# EAGLE design microBoard_HMI (EAGLE 6.2)

## Sheet 1 of 3: Power Supplies & Interfaces
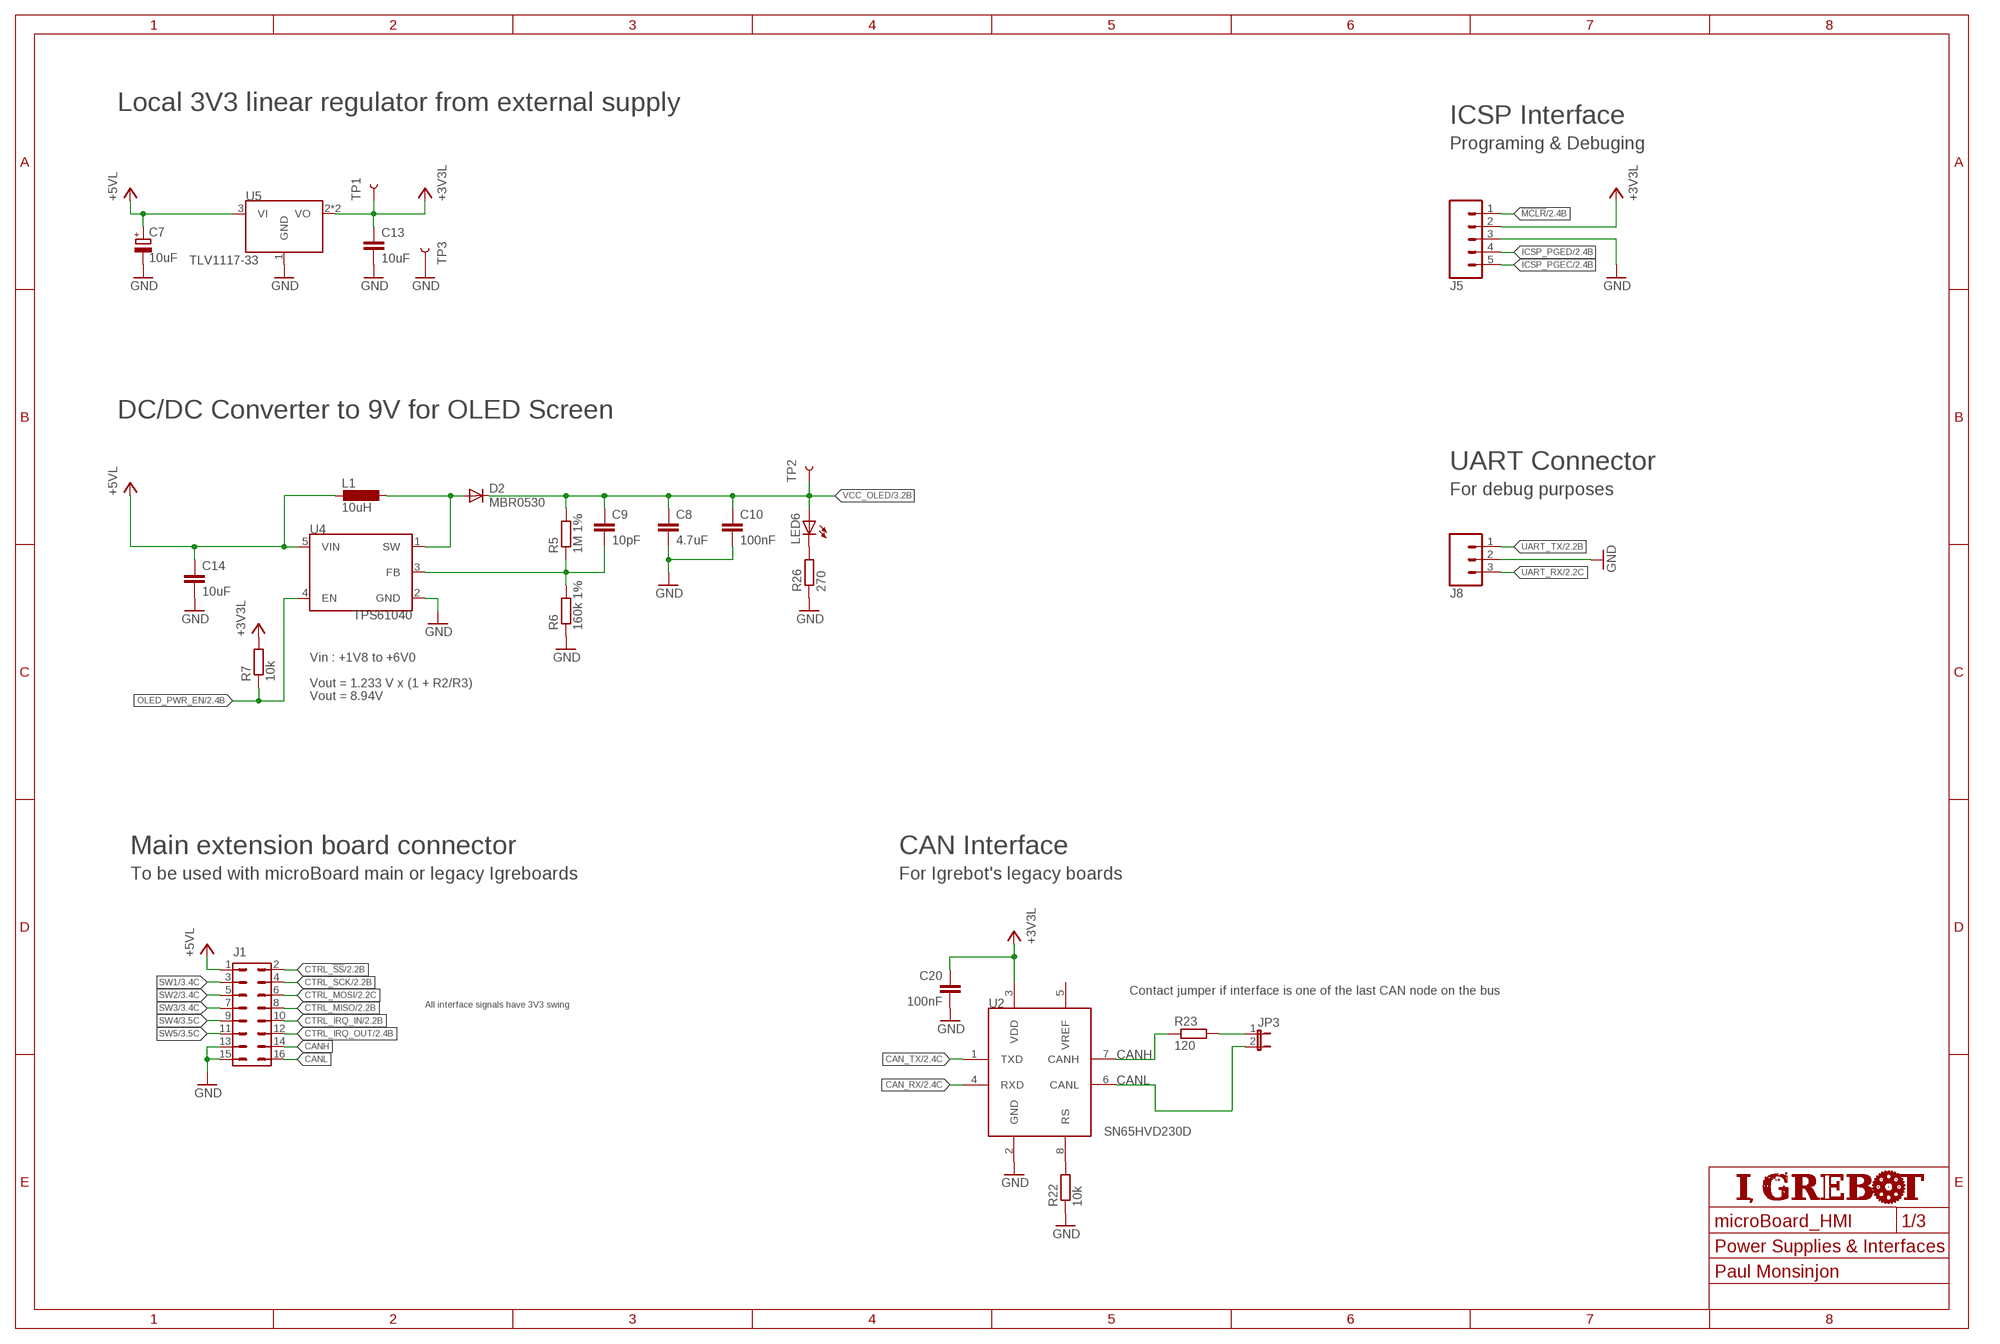
[diagram p0: schematic, sheet 1]
POWER-SUPPLIES2 (FRAME_A3): AUTHOR: Paul Monsinjon; SHEET_NAME: Power Supplies & Interfaces

### Parts
C7  10uF  CPOL-EUC  [PANASONIC_C]
C8  4.7uF  C-EUC1206  [C1206]
C9  10pF  C-EUC0603  [C0603]
C10  100nF  C-EUC0603  [C0603]
C13  10uF  C-EUC1206  [C1206]
C14  10uF  C-EUC1206  [C1206]
C20  100nF  C-EUC0603  [C0603]
D2  MBR0530  CGRM4001-G  [SOD-123_MINI-SMA]
J1  HE10_H_16  [CON_2X_2.54_H_16]
J5  M05LOCK  [1X05_LOCK]
J8  M03LOCK  [1X03_LOCK]
JP3  JUMPER-2PTH_LOCK  [1X02_LOCK]
L1  10uH  L-EUL5650M  [L5650M]
LED6  LEDCHIP-LED0805  [CHIP-LED0805]
R5  1M 1%  R-EU_R0603  [R0603]
R6  160k 1%  R-EU_R0603  [R0603]
R7  10k  R-EU_R0603  [R0603]
R22  10k  R-EU_R0603  [R0603]
R23  120  R-EU_R0603  [R0603]
R26  270  R-EU_R0603  [R0603]
TP1  TEST-POINT3X5  [PAD.03X.05]
TP2  TEST-POINT3X5  [PAD.03X.05]
TP3  TEST-POINT3X5  [PAD.03X.05]
U2  SN65HVD230D  MCP2551  [SO-08]
U4  TPS61040  [SOT-23]
U5  TLV1117-33  NX1117C  [SOT_223]

### Nets
!MCLR!: J5.1 ; also sheet 2
+3V3L: C13.1 C20.1 J5.2 R7.2 TP1.P$1 U2.3(VDD) U5.2(VO) U5.4(VO) ; also sheet 2,3
+5VL: C7.+ C14.1 J1.1 L1.2 U4.5(VIN) U5.3(VI) ; also sheet 3
CAN_RX: U2.4(RXD) ; also sheet 2
CAN_TX: U2.1(TXD) ; also sheet 2
CANH: J1.14 R23.1 U2.7(CANH)
CANL: J1.16 JP3.2 U2.6(CANL)
CTRL_!SS!: J1.2 ; also sheet 2
CTRL_IRQ_IN: J1.10 ; also sheet 2
CTRL_IRQ_OUT: J1.12 ; also sheet 2
CTRL_MISO: J1.8 ; also sheet 2
CTRL_MOSI: J1.6 ; also sheet 2
CTRL_SCK: J1.4 ; also sheet 2
GND: C7.- C8.2 C10.2 C13.2 C14.2 C20.2 J1.13 J1.15 J5.3 J8.2 R6.1 R22.1 R26.1 TP3.P$1 U2.2(GND) U4.2(GND) U5.1(GND) ; also sheet 2,3
ICSP_PGEC: J5.5 ; also sheet 2
ICSP_PGED: J5.4 ; also sheet 2
N$3: D2.A L1.1 U4.1(SW)
N$5: C9.2 R5.1 R6.2 U4.3(FB)
N$8: LED6.C R26.2
N$15: JP3.1 R23.2
N$22: R22.2 U2.8(RS)
OLED_PWR_EN: R7.1 U4.4(EN) ; also sheet 2
SW1: J1.3 ; also sheet 3
SW2: J1.5 ; also sheet 3
SW3: J1.7 ; also sheet 3
SW4: J1.9 ; also sheet 3
SW5: J1.11 ; also sheet 3
UART_RX: J8.3 ; also sheet 2
UART_TX: J8.1 ; also sheet 2
VCC_OLED: C8.1 C9.1 C10.1 D2.C LED6.A R5.2 TP2.P$1 ; also sheet 3
Unconnected: U2.5(VREF)

### Notes on the sheet
- Local 3V3 linear regulator from external supply
- ICSP Interface
- Programing & Debuging
- DC/DC Converter to 9V for OLED Screen
- UART Connector
- For debug purposes
- Vin : +1V8 to +6V0
- Vout = 1.233 V x (1 + R2/R3)
- Vout = 8.94V
- Main extension board connector | CAN Interface
- To be used with microBoard main or legacy Igreboards | For Igrebot's legacy boards
- Contact jumper if interface is one of the last CAN node on the bus
- All interface signals have 3V3 swing

## Sheet 2 of 3: Microcontroller
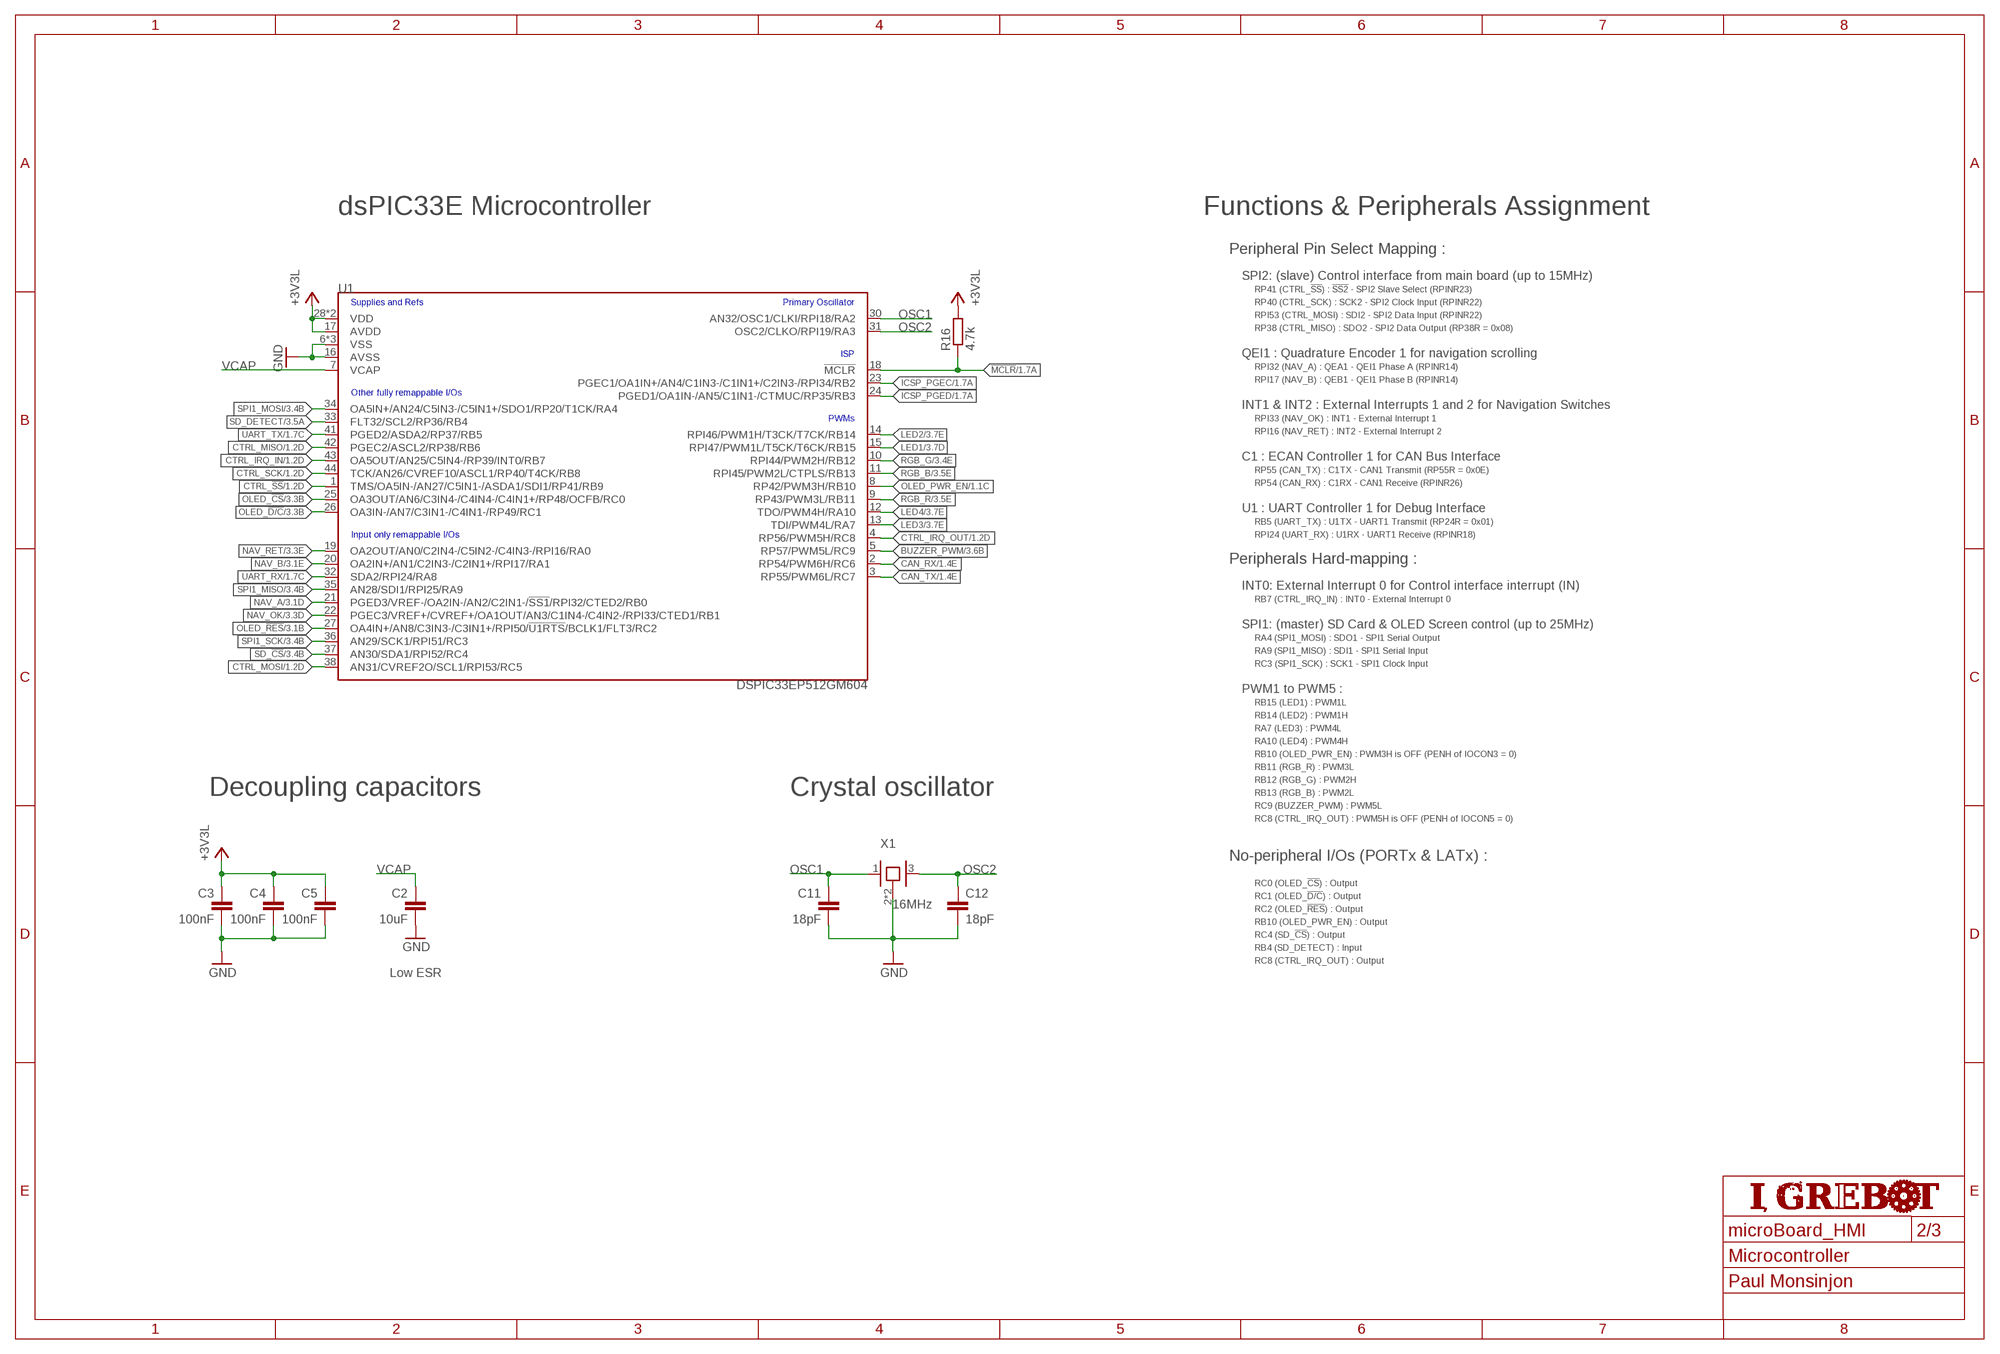
[diagram p1: schematic, sheet 2]
POWER-SUPPLIES1 (FRAME_A3): AUTHOR: Paul Monsinjon; SHEET_NAME: Microcontroller

### Parts
C2  10uF  C-EUC1206  [C1206]
C3  100nF  C-EUC0603  [C0603]
C4  100nF  C-EUC0603  [C0603]
C5  100nF  C-EUC0603  [C0603]
C11  18pF  C-EUC0603  [C0603]
C12  18pF  C-EUC0603  [C0603]
R16  4.7k  R-EU_R0603  [R0603]
U1  DSPIC33EP512GM604  [TQFP_44]
X1  16MHz  XTAL_5X3  [CRYSTAL-OSC-SMD-5X3]

### Nets
!MCLR!: R16.1 U1.18(!MCLR!) ; also sheet 1
+3V3L: C3.1 C4.1 C5.1 R16.2 U1.17(AVDD) U1.28(VDD) U1.40(VDD) ; also sheet 1,3
BUZZER_PWM: U1.5(RP57/PWM5L/RC9) ; also sheet 3
CAN_RX: U1.2(RP54/PWM6H/RC6) ; also sheet 1
CAN_TX: U1.3(RP55/PWM6L/RC7) ; also sheet 1
CTRL_!SS!: U1.1(TMS/OA5IN-/AN27/C5IN1-/ASDA1/SDI1/RP41/RB9) ; also sheet 1
CTRL_IRQ_IN: U1.43(OA5OUT/AN25/C5IN4-/RP39/INT0/RB7) ; also sheet 1
CTRL_IRQ_OUT: U1.4(RP56/PWM5H/RC8) ; also sheet 1
CTRL_MISO: U1.42(PGEC2/ASCL2/RP38/RB6) ; also sheet 1
CTRL_MOSI: U1.38(AN31/CVREF2O/SCL1/RPI53/RC5) ; also sheet 1
CTRL_SCK: U1.44(TCK/AN26/CVREF10/ASCL1/RP40/T4CK/RB8) ; also sheet 1
GND: C2.2 C3.2 C4.2 C5.2 C11.2 C12.2 U1.6(VSS) U1.16(AVSS) U1.29(VSS) U1.39(VSS) X1.2 X1.4 ; also sheet 1,3
ICSP_PGEC: U1.23(PGEC1/OA1IN+/AN4/C1IN3-/C1IN1+/C2IN3-/RPI34/RB2) ; also sheet 1
ICSP_PGED: U1.24(PGED1/OA1IN-/AN5/C1IN1-/CTMUC/RP35/RB3) ; also sheet 1
LED1: U1.15(RPI47/PWM1L/T5CK/T6CK/RB15) ; also sheet 3
LED2: U1.14(RPI46/PWM1H/T3CK/T7CK/RB14) ; also sheet 3
LED3: U1.13(TDI/PWM4L/RA7) ; also sheet 3
LED4: U1.12(TDO/PWM4H/RA10) ; also sheet 3
NAV_A: U1.21(PGED3/VREF-/OA2IN-/AN2/C2IN1-/!SS1!/RPI32/CTED2/RB0) ; also sheet 3
NAV_B: U1.20(OA2IN+/AN1/C2IN3-/C2IN1+/RPI17/RA1) ; also sheet 3
NAV_OK: U1.22(PGEC3/VREF+/CVREF+/OA1OUT/AN3/C1IN4-/C4IN2-/RPI33/CTED1/RB1) ; also sheet 3
NAV_RET: U1.19(OA2OUT/AN0/C2IN4-/C5IN2-/C4IN3-/RPI16/RA0) ; also sheet 3
OLED_!CS!: U1.25(OA3OUT/AN6/C3IN4-/C4IN4-/C4IN1+/RP48/OCFB/RC0) ; also sheet 3
OLED_!D/C!: U1.26(OA3IN-/AN7/C3IN1-/C4IN1-/RP49/RC1) ; also sheet 3
OLED_!RES!: U1.27(OA4IN+/AN8/C3IN3-/C3IN1+/RPI50/!U1RTS!/BCLK1/FLT3/RC2) ; also sheet 3
OLED_PWR_EN: U1.8(RP42/PWM3H/RB10) ; also sheet 1
OSC1: C11.1 U1.30(AN32/OSC1/CLKI/RPI18/RA2) X1.1
OSC2: C12.1 U1.31(OSC2/CLKO/RPI19/RA3) X1.3
RGB_B: U1.11(RPI45/PWM2L/CTPLS/RB13) ; also sheet 3
RGB_G: U1.10(RPI44/PWM2H/RB12) ; also sheet 3
RGB_R: U1.9(RP43/PWM3L/RB11) ; also sheet 3
SD_!CS!: U1.37(AN30/SDA1/RPI52/RC4) ; also sheet 3
SD_DETECT: U1.33(FLT32/SCL2/RP36/RB4) ; also sheet 3
SPI1_MISO: U1.35(AN28/SDI1/RPI25/RA9) ; also sheet 3
SPI1_MOSI: U1.34(OA5IN+/AN24/C5IN3-/C5IN1+/SDO1/RP20/T1CK/RA4) ; also sheet 3
SPI1_SCK: U1.36(AN29/SCK1/RPI51/RC3) ; also sheet 3
UART_RX: U1.32(SDA2/RPI24/RA8) ; also sheet 1
UART_TX: U1.41(PGED2/ASDA2/RP37/RB5) ; also sheet 1
VCAP: C2.1 U1.7(VCAP)

### Notes on the sheet
- dsPIC33E Microcontroller | Functions & Peripherals Assignment
- Peripheral Pin Select Mapping :
- SPI2: (slave) Control interface from main board (up to 15MHz)
- RP41 (CTRL_!SS!) : !SS2! - SPI2 Slave Select (RPINR23)
- RP40 (CTRL_SCK) : SCK2 - SPI2 Clock Input (RPINR22)
- RPI53 (CTRL_MOSI) : SDI2 - SPI2 Data Input (RPINR22)
- RP38 (CTRL_MISO) : SDO2 - SPI2 Data Output (RP38R = 0x08)
- QEI1 : Quadrature Encoder 1 for navigation scrolling
- RPI32 (NAV_A) : QEA1 - QEI1 Phase A (RPINR14)
- RPI17 (NAV_B) : QEB1 - QEI1 Phase B (RPINR14)
- INT1 & INT2 : External Interrupts 1 and 2 for Navigation Switches
- RPI33 (NAV_OK) : INT1 - External Interrupt 1
- RPI16 (NAV_RET) : INT2 - External Interrupt 2
- C1 : ECAN Controller 1 for CAN Bus Interface
- RP55 (CAN_TX) : C1TX - CAN1 Transmit (RP55R = 0x0E)
- RP54 (CAN_RX) : C1RX - CAN1 Receive (RPINR26)
- U1 : UART Controller 1 for Debug Interface
- RB5 (UART_TX) : U1TX - UART1 Transmit (RP24R = 0x01)
- RPI24 (UART_RX) : U1RX - UART1 Receive (RPINR18)
- Peripherals Hard-mapping :
- INT0: External Interrupt 0 for Control interface interrupt (IN)
- RB7 (CTRL_IRQ_IN) : INT0 - External Interrupt 0
- SPI1: (master) SD Card & OLED Screen control (up to 25MHz)
- RA4 (SPI1_MOSI) : SDO1 - SPI1 Serial Output
- RA9 (SPI1_MISO) : SDI1 - SPI1 Serial Input
- RC3 (SPI1_SCK) : SCK1 - SPI1 Clock Input
- PWM1 to PWM5 :
- RB15 (LED1) : PWM1L
- RB14 (LED2) : PWM1H
- RA7 (LED3) : PWM4L
- RA10 (LED4) : PWM4H
- RB10 (OLED_PWR_EN) : PWM3H is OFF (PENH of IOCON3 = 0)
- RB11 (RGB_R) : PWM3L
- RB12 (RGB_G) : PWM2H
- Decoupling capacitors | Crystal oscillator | RB13 (RGB_B) : PWM2L
- RC9 (BUZZER_PWM) : PWM5L
- RC8 (CTRL_IRQ_OUT) : PWM5H is OFF (PENH of IOCON5 = 0)
- No-peripheral I/Os (PORTx & LATx) :
- RC0 (OLED_!CS!) : Output
- RC1 (OLED_!D/C!) : Output
- RC2 (OLED_!RES!) : Output
- RB10 (OLED_PWR_EN) : Output
- RC4 (SD_!CS!) : Output
- RB4 (SD_DETECT) : Input
- RC8 (CTRL_IRQ_OUT) : Output
- Low ESR

## Sheet 3 of 3: Human Machine Interfaces
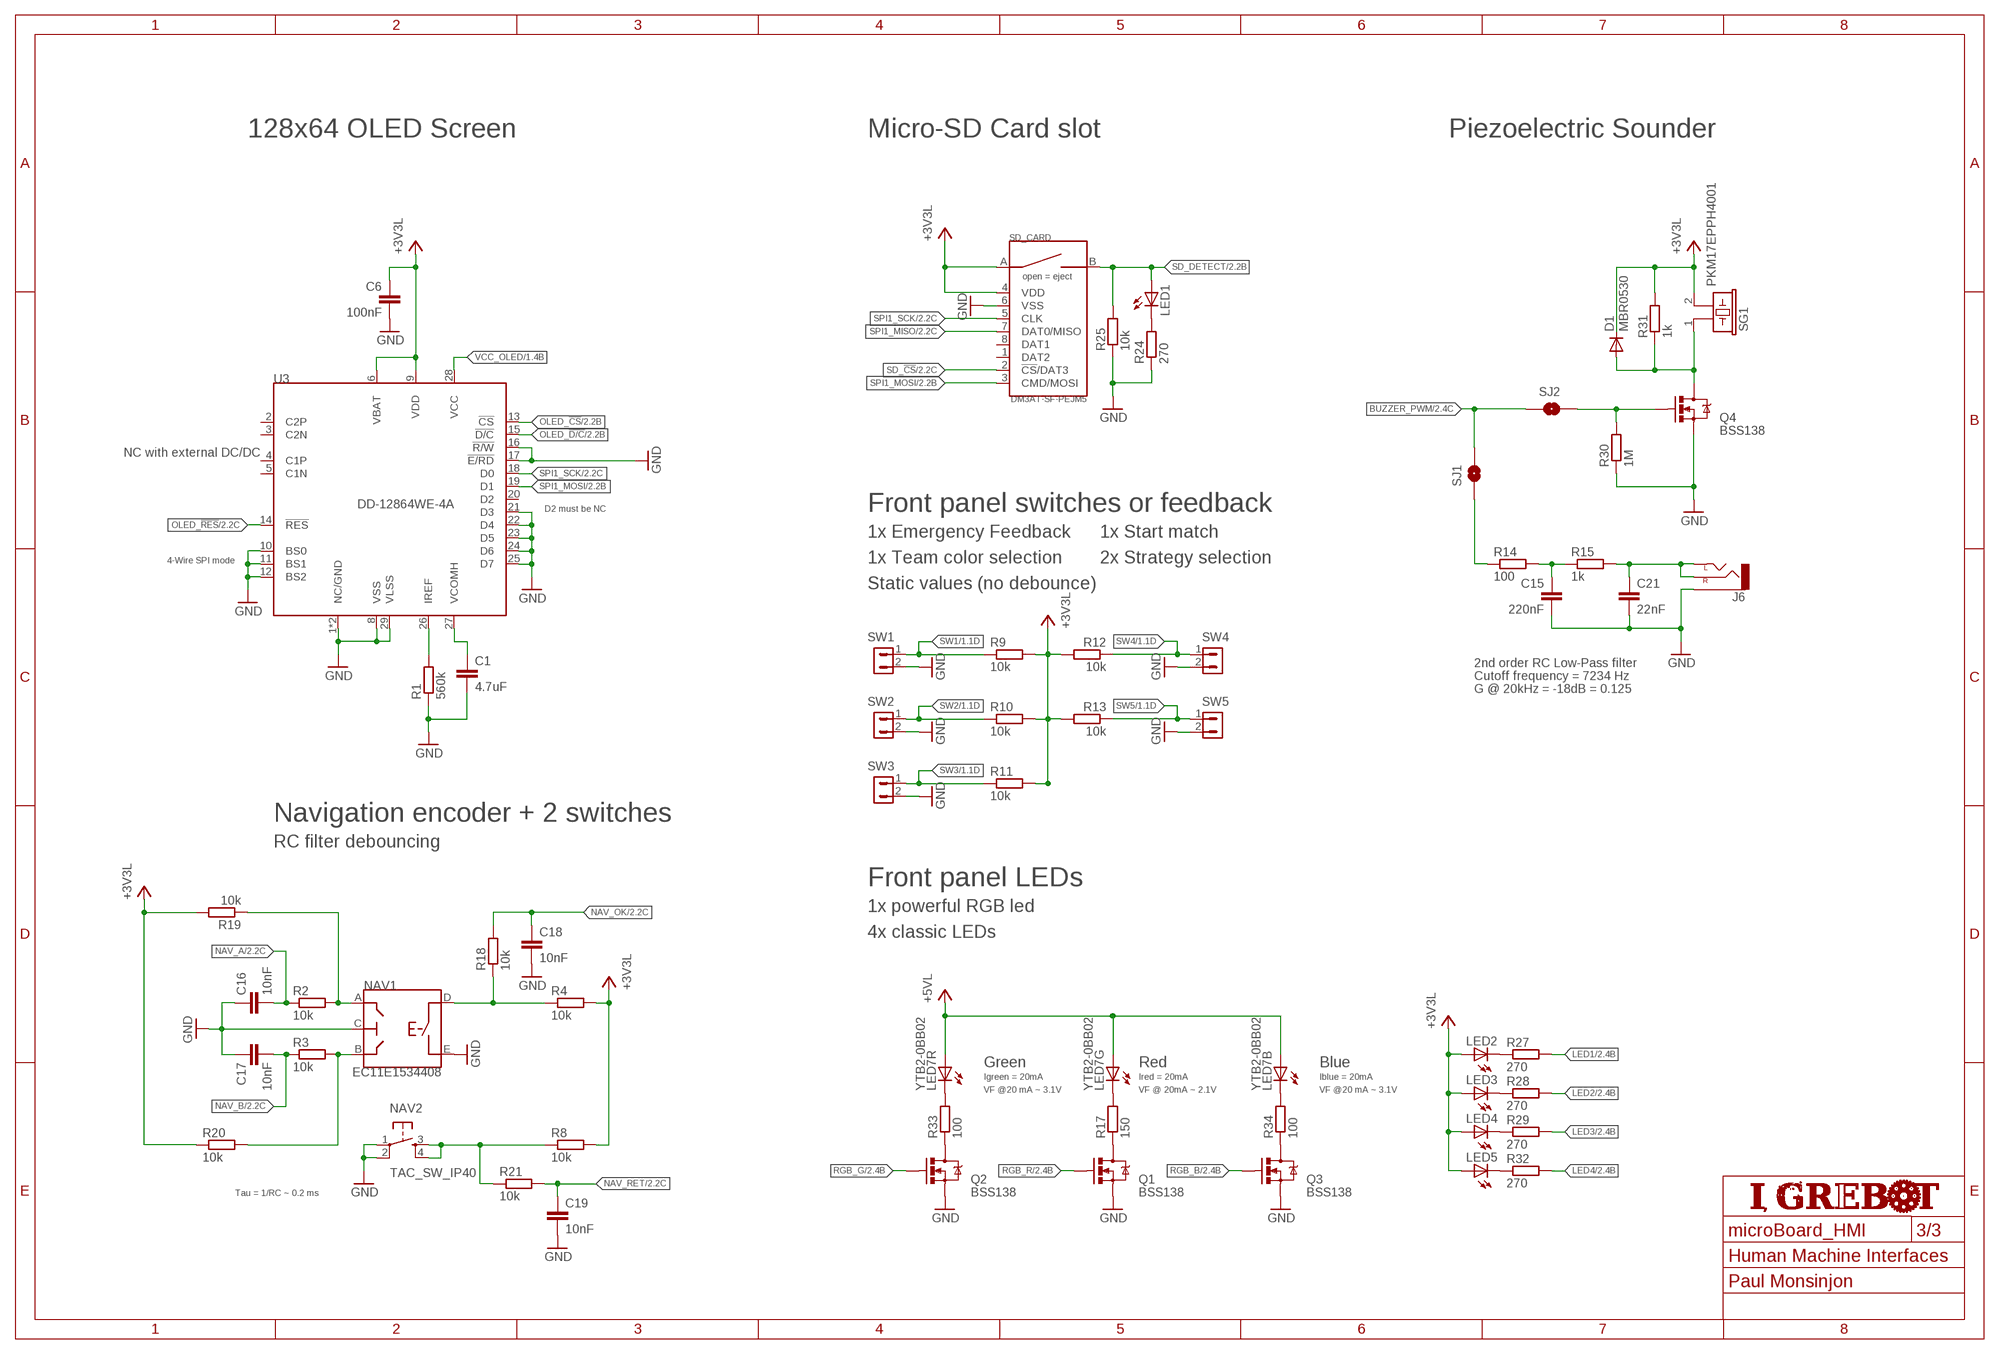
[diagram p2: schematic, sheet 3]
POWER-SUPPLIES (FRAME_A3): AUTHOR: Paul Monsinjon; SHEET_NAME: Human Machine Interfaces

### Parts
C1  4.7uF  C-EUC1206  [C1206]
C6  100nF  C-EUC0603  [C0603]
C15  220nF  C-EUC0603  [C0603]
C16  10nF  C-EUC0603  [C0603]
C17  10nF  C-EUC0603  [C0603]
C18  10nF  C-EUC0603  [C0603]
C19  10nF  C-EUC0603  [C0603]
C21  22nF  C-EUC0603  [C0603]
D1  MBR0530  CGRM4001-G  [SOD-123_MINI-SMA]
J6  AUDIO-JACK1:1  [STEREOJACK2.5MM]
LED1  LEDCHIP-LED0805  [CHIP-LED0805]
LED2  LEDCHIP-LED0805  [CHIP-LED0805]
LED3  LEDCHIP-LED0805  [CHIP-LED0805]
LED4  LEDCHIP-LED0805  [CHIP-LED0805]
LED5  LEDCHIP-LED0805  [CHIP-LED0805]
LED7  YTB2-0BB02  GM5WA94310A  [GM5WA94310A]
NAV1  EC11E1534408  [EC11E1534408]
NAV2  TAC_SW_IP40  [TAC_SW_IP40]
Q1  BSS138  MOSFET-NCHANNELBSS138  [SOT23]
Q2  BSS138  MOSFET-NCHANNELBSS138  [SOT23]
Q3  BSS138  MOSFET-NCHANNELBSS138  [SOT23]
Q4  BSS138  MOSFET-NCHANNELBSS138  [SOT23]
R1  560k  R-EU_R0603  [R0603]
R2  10k  R-EU_R0603  [R0603]
R3  10k  R-EU_R0603  [R0603]
R4  10k  R-EU_R0603  [R0603]
R8  10k  R-EU_R0603  [R0603]
R9  10k  R-EU_R0603  [R0603]
R10  10k  R-EU_R0603  [R0603]
R11  10k  R-EU_R0603  [R0603]
R12  10k  R-EU_R0603  [R0603]
R13  10k  R-EU_R0603  [R0603]
R14  100  R-EU_R0603  [R0603]
R15  1k  R-EU_R0603  [R0603]
R17  150  R-EU_R0603  [R0603]
R18  10k  R-EU_R0603  [R0603]
R19  10k  R-EU_R0603  [R0603]
R20  10k  R-EU_R0603  [R0603]
R21  10k  R-EU_R0603  [R0603]
R24  270  R-EU_R0603  [R0603]
R25  10k  R-EU_R0603  [R0603]
R27  270  R-EU_R0603  [R0603]
R28  270  R-EU_R0603  [R0603]
R29  270  R-EU_R0603  [R0603]
R30  1M  R-EU_R0603  [R0603]
R31  1k  R-EU_R0603  [R0603]
R32  270  R-EU_R0603  [R0603]
R33  100  R-EU_R0603  [R0603]
R34  100  R-EU_R0603  [R0603]
SD_CARD  DM3AT-SF-PEJM5  [DM3AT]
SG1  PKM17EPPH4001  F/EE17P  [F/EE17P]
SJ1  SOLDERJUMPERNC2  [SJ_2S-NOTRACE]
SJ2  SOLDERJUMPERNC2  [SJ_2S-NOTRACE]
SW1  HE14_H_2  [HE14_H_2]
SW2  HE14_H_2  [HE14_H_2]
SW3  HE14_H_2  [HE14_H_2]
SW4  HE14_H_2  [HE14_H_2]
SW5  HE14_H_2  [HE14_H_2]
U3  DD-12864WE-4A  [DD-12864WE-4A]

### Nets
+3V3L: C6.1 D1.C LED2.A LED3.A LED4.A LED5.A R4.2 R8.2 R9.2 R10.2 R11.2 R12.2 R13.2 R19.2 R20.1 R31.2 SD_CARD.4(VDD) SD_CARD.A SG1.2 U3.6(VBAT) U3.9(VDD) ; also sheet 1,2
+5VL: LED7.1(B:A) LED7.2(R:A) LED7.3(G:A) ; also sheet 1
BUZZER_PWM: SJ1.2 SJ2.1 ; also sheet 2
GND: C1.2 C6.2 C15.2 C16.1 C17.1 C18.2 C19.2 C21.2 J6.5(SLEEVE) NAV1.C NAV1.E NAV2.1 NAV2.2 Q1.2(S) Q2.2(S) Q3.2(S) Q4.2(S) R1.1 R24.1 R25.1 R30.1 SD_CARD.6(VSS) SW1.2 SW2.2 SW3.2 SW4.2 SW5.2 U3.1(NC/GND) U3.8(VSS) U3.10(BS0) U3.11(BS1) U3.12(BS2) U3.16(!R/W!) U3.17(!E/RD!) U3.21(D3) U3.22(D4) U3.23(D5) U3.24(D6) U3.25(D7) U3.29(VLSS) U3.30(NC/GND) ; also sheet 1,2
LED1: R27.2 ; also sheet 2
LED2: R28.2 ; also sheet 2
LED3: R29.2 ; also sheet 2
LED4: R32.2 ; also sheet 2
N$1: R1.2 U3.26(IREF)
N$2: C1.1 U3.27(VCOMH)
N$4: LED7.5(R:C) R33.2
N$6: LED7.4(G:C) R17.2
N$7: LED7.6(B:C) R34.2
N$9: Q2.3(D) R33.1
N$10: Q1.3(D) R17.1
N$11: Q3.3(D) R34.1
N$12: C21.1 J6.1(LEFT) J6.4(RIGHT) R15.2
N$13: D1.A Q4.3(D) R31.1 SG1.1
N$14: C15.1 R14.2 R15.1
N$16: R14.1 SJ1.1
N$17: LED1.C R24.2
N$18: NAV1.A R2.2 R19.1
N$19: NAV1.B R3.2 R20.2
N$20: NAV1.D R4.1 R18.1
N$21: NAV2.3 NAV2.4 R8.1 R21.1
N$24: Q4.1(G) R30.2 SJ2.2
N$37: LED2.C R27.1
N$39: LED3.C R28.1
N$40: LED4.C R29.1
N$41: LED5.C R32.1
NAV_A: C16.2 R2.1 ; also sheet 2
NAV_B: C17.2 R3.1 ; also sheet 2
NAV_OK: C18.1 R18.2 ; also sheet 2
NAV_RET: C19.1 R21.2 ; also sheet 2
OLED_!CS!: U3.13(!CS!) ; also sheet 2
OLED_!D/C!: U3.15(!D/C!) ; also sheet 2
OLED_!RES!: U3.14(!RES!) ; also sheet 2
RGB_B: Q3.1(G) ; also sheet 2
RGB_G: Q2.1(G) ; also sheet 2
RGB_R: Q1.1(G) ; also sheet 2
SD_!CS!: SD_CARD.2(!CS!/DAT3) ; also sheet 2
SD_DETECT: LED1.A R25.2 SD_CARD.B ; also sheet 2
SPI1_MISO: SD_CARD.7(DAT0/MISO) ; also sheet 2
SPI1_MOSI: SD_CARD.3(CMD/MOSI) U3.19(D1) ; also sheet 2
SPI1_SCK: SD_CARD.5(CLK) U3.18(D0) ; also sheet 2
SW1: R9.1 SW1.1 ; also sheet 1
SW2: R10.1 SW2.1 ; also sheet 1
SW3: R11.1 SW3.1 ; also sheet 1
SW4: R12.1 SW4.1 ; also sheet 1
SW5: R13.1 SW5.1 ; also sheet 1
VCC_OLED: U3.28(VCC) ; also sheet 1
Unconnected: SD_CARD.1(DAT2) SD_CARD.8(DAT1) U3.2(C2P) U3.3(C2N) U3.4(C1P) U3.5(C1N) U3.20(D2)

### Notes on the sheet
- 128x64 OLED Screen | Micro-SD Card slot | Piezoelectric Sounder
- NC with external DC/DC
- D2 must be NC | Front panel switches or feedback
- 1x Emergency Feedback | 1x Start match
- 4-Wire SPI mode | 1x Team color selection | 2x Strategy selection
- Static values (no debounce)
- 2nd order RC Low-Pass filter
- Cutoff frequency = 7234 Hz
- G @ 20kHz = -18dB = 0.125
- Navigation encoder + 2 switches
- RC filter debouncing
- Front panel LEDs
- 1x powerful RGB led
- 4x classic LEDs
- Green | Red | Blue
- Igreen = 20mA | Ired = 20mA | Iblue = 20mA
- VF @20 mA ~ 3.1V | VF @ 20mA ~ 2.1V | VF @20 mA ~ 3.1V
- Tau = 1/RC ~ 0.2 ms

## Library data of the parts
C1-C6 C8-C21 = rcl:C-EU: CAPACITOR, European symbol
C7 = rcl:CPOL-EU: POLARIZED CAPACITOR, European symbol
D1 D2 = diode:CGRM400*-G: Molded plasitc,JEDEC SOD-123/Mini SMA Source: Comchip CGRM4001-G.pdf
J1 = microLib:HE10_H_16
J5 = SparkFun-Connectors:M05: Header 5 Standard 5-pin 0.1" header. Use with straight break away headers (SKU : PRT-00116), right angle break away headers (PRT-00553), swiss pins (PRT-00743), machine pins (PRT-00117), and female headers (PRT-00115). Molex polarized connector foot print use with SKU : PRT-08230 with associated crimp pins and housings.
J6 = SparkFun-Connectors:AUDIO-JACK: 3.5mm Audio Jack Simple 3.5mm common PCB mount audio jack. SKU: PRT-08032
J8 = SparkFun-Connectors:M03: Header 3 Standard 3-pin 0.1" header. Use with straight break away headers (SKU : PRT-00116), right angle break away headers (PRT-00553), swiss pins (PRT-00743), machine pins (PRT-00117), and female headers (PRT-00115). Molex polarized connector foot print use with SKU : PRT-08232 with associated crimp pins and housings.
JP3 = SparkFun-Passives:JUMPER-2: Jumper Basic 0.1" spaced jumper. Use with breakaway headers.
L1 = rcl:L-EU: INDUCTOR, European symbol
LED1-LED6 = led:LED: LED OSRAM: - CHIPLED LG R971, LG N971, LY N971, LG Q971, LY Q971, LO R971, LY R971 LH N974, LH R974 LS Q976, LO Q976, LY Q976 LO Q996 - Hyper CHIPLED LW Q18S LB Q993, LB Q99A, LB R99A - SideLED LS A670, LO A670, LY A670, LG A670, LP A670 LB A673, LV A673, LT A673, LW A673 LH A674 LY A675 LS A676, LA A676, LO A676, LY A676, LW A676 LS A679, LY A679, LG A679 - Hyper Micro SIDELED® LS Y876, LA Y876, LO Y876, LY Y876 LT Y87S - SmartLED LW L88C, LW L88S LB L89C, LB L89S, LG L890 LS L89K, LO L89K, LY L89K LS L896, LA L896, LO L896, LY L896 - TOPLED LS T670, LO T670, LY T670, LG T670, LP T670 LSG T670, LSP T670, LSY T670, LOP T670, LYG T670 LG T671, LOG T671, LSG T671 LB T673, LV T673, LT T673, LW T673 LH T674 LS T676, LA T676, LO T676, LY T676, LB T676, LH T676, LSB T676, LW T676 LB T67C, LV T67C, LT T67C, LS T67K, LO T67K, LY T67K, LW E67C LS E67B, LA E67B, LO E67B, LY E67B, LB E67C, LV E67C, LT E67C LW T67C LS T679, LY T679, LG T679 LS T770, LO T770, LY T770, LG T770, LP T770 LB T773, LV T773, LT T773, LW T773 LH T774 LS E675, LA E675, LY E675, LS T675 LS T776, LA T776, LO T776, LY T776, LB T776 LHGB T686 LT T68C, LB T68C - Hyper Mini TOPLED® LB M676 - Mini TOPLED Santana® LG M470 LS M47K, LO M47K, LY M47K Source: http://www.osram.convergy.de LUXEON: - LUMILED® LXK2-PW12-R00, LXK2-PW12-S00, LXK2-PW14-U00, LXK2-PW14-V00 LXK2-PM12-R00, LXK2-PM12-S00, LXK2-PM14-U00 LXK2-PE12-Q00, LXK2-PE12-R00, LXK2-PE12-S00, LXK2-PE14-T00, LXK2-PE14-U00 LXK2-PB12-K00, LXK2-PB12-L00, LXK2-PB12-M00, LXK2-PB14-N00, LXK2-PB14-P00, LXK2-PB14-Q00 LXK2-PR12-L00, LXK2-PR12-M00, LXK2-PR14-Q00, LXK2-PR14-R00 LXK2-PD12-Q00, LXK2-PD12-R00, LXK2-PD12-S00 LXK2-PH12-R00, LXK2-PH12-S00 LXK2-PL12-P00, LXK2-PL12-Q00, LXK2-PL12-R00 Source: www.luxeon.com KINGBRIGHT: KA-3528ASYC Source: www.kingbright.com
LED7 = led:GM5WA94310A: Chip LED RGB Source: http://document.sharpsma.com/files/GM5WA94310A_SS.pdf
NAV1 = microLib:EC11E1534408
NAV2 = microLib:TAC_SW_IP40
Q1-Q4 = SparkFun-DiscreteSemi:MOSFET-NCHANNEL: Common NMOSFET Parts MFG P/N Store ID Prod ID FDD8780 TRANS-09984 SI7820DN TRANS-11055 FDS6630A IC-08089 2N7002PW TRANS-11151 FQP30N06L COM-10213 TRANS-10060 BSS123LT1G TRANS-08345 BSS138 TRANS-00830 BS170 2N7000; PROD_ID: TRANS-00830
R1-R13 R18-R23 = rcl:R-EU_: RESISTOR, European symbol
R14-R17 R24-R34 = resistor:R-EU_: RESISTOR, European symbol
SD_CARD = microLib:DM3AT-SF-PEJM5
SG1 = buzzer:F/EE17P: BUZZER Source: Buerklin; OC_FARNELL: unknown; OC_NEWARK: unknown
SJ1 SJ2 = SparkFun-Passives:SOLDERJUMPER: Solder Jumper Standard SMD solder jumper. Used to automate production. Two varients : Normally Open and Normally Closed are the same, but have different paste layers. NC will have a large amount of paste and should jumper during reflow.
SW1-SW5 = microLib:HE14_H_2
TP1-TP3 = SparkFun-Passives:TEST-POINT: Bare copper test points for troubleshooting or ICT
U1 = microLib:DSPIC33EP512GM604
U2 = 0SBLib:MCP2551: High-Speed CAN Transceiver
U3 = microLib:DD-12864WE-4A
U4 = microLib:TPS61040
U5 = microLib:NX1117C
X1 = microLib:XTAL_5X3

## Board
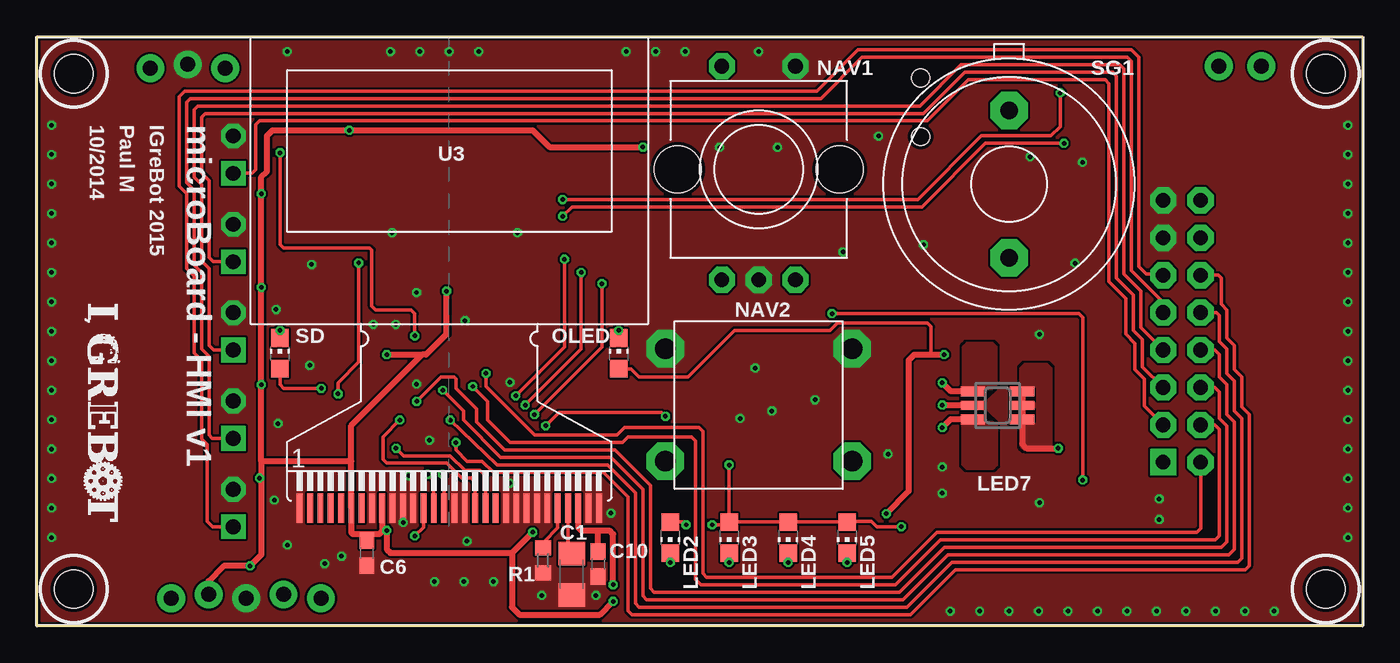
[diagram p3: board, top side]
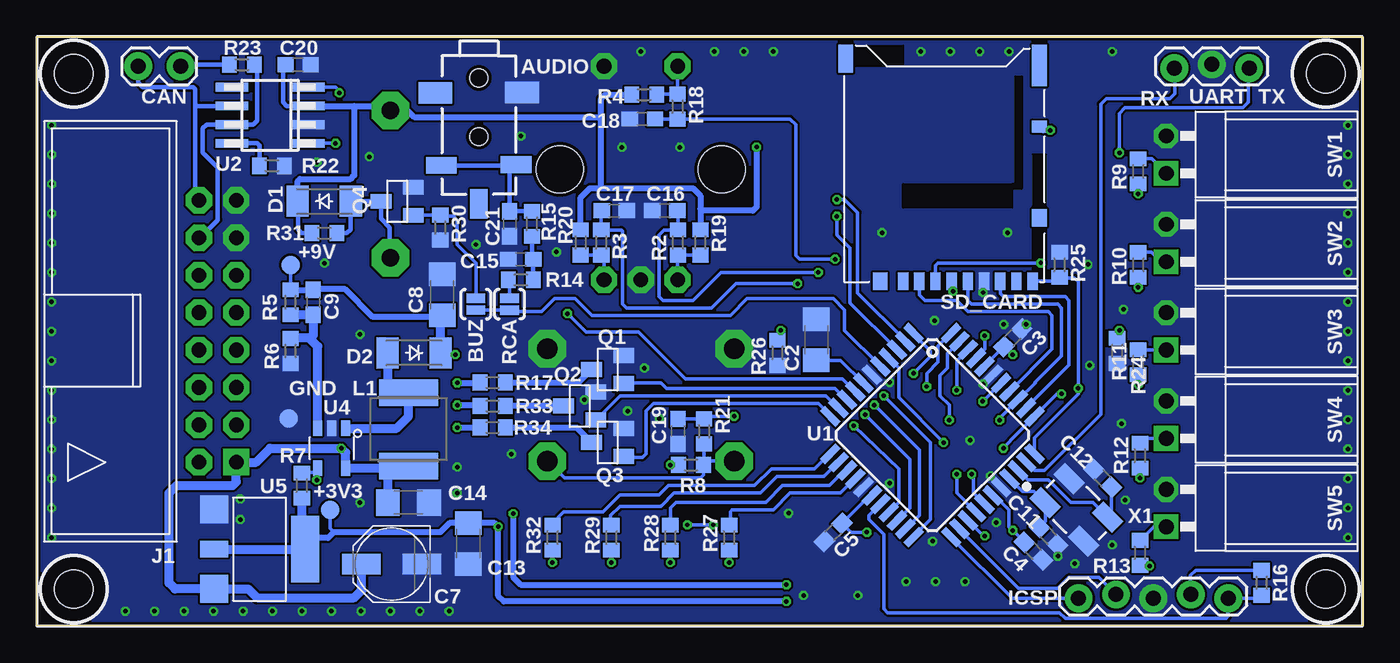
[diagram p4: board, bottom side, seen from below]

Size 90 x 40 mm. Coordinates in mm from the lower left corner, seen from the top.
Outline: 0,0 90,0 90,40 0,40 0,0
Copper layers (1*16): Top 0.035mm / dielectric 1.5mm / Bottom 0.035mm
Design rules: minimum track width 6mil, minimum drill 12mil, track to track 6mil, track to pad 6mil, pad to pad 6mil, via to via 6mil, smd to smd 0mil, copper to edge 10mil, drill to drill 10mil, minimum pad ring 10mil, minimum via ring 6mil, stop-mask expansion 2mil, vias tented up to drill 100mil, thermal gap 10mil
Holes 2.6 mm at 2.5,37.5 2.5,2.5 87.5,37.5 87.5,2.5
bRestrict: area 0.2,0.2 to 4.8,4.8; area 0.2,35.2 to 4.8,39.8; area 85.2,35.2 to 89.8,39.8; area 85.2,0.2 to 89.8,4.8

### Footprints (pad centres in the part's own frame; a part is rotated, then mirrored left to right if it is on the bottom)
C1206 = smd 1.6 x 1.8: 1 -1.4,0; 2 1.4,0
C0603 = smd 1.1 x 1: 1 -0.85,0; 2 0.85,0
PANASONIC_C = smd 2.6 x 1.4: + 2.05,0; - -2.05,0
SOD-123_MINI-SMA = smd 1.5 x 2.1: A 1.8,0; C -1.8,0
CON_2X_2.54_H_16 = drill 1 pad 1.778 square: 1 8.89,2.54 | drill 1 pad 1.778 octagon: 2 8.89,0; 3 6.35,2.54; 4 6.35,0; 5 3.81,2.54; 6 3.81,0; 7 1.27,2.54; 8 1.27,0; 9 -1.27,2.54; 10 -1.27,0; 11 -3.81,2.54; 12 -3.81,0; 13 -6.35,2.54; 14 -6.35,0; 15 -8.89,2.54; 16 -8.89,0
1X05_LOCK = drill 1.016 pad 1.88: 1 0,0.127; 2 2.54,-0.127; 3 5.08,0.127; 4 7.62,-0.127; 5 10.16,0.127
STEREOJACK2.5MM = smd 1.144 x 2.1: 1 5.898,2.54 | smd 1.998 x 1.17: 3 8.55,0 | smd 1.119 x 2.1: 4 5.949,-2.54 | smd 1.467 x 2.3: 5 1,2.952; A 1.016,-2.952 | hole 1.2: 0,0; 4,0
1X03_LOCK = drill 1.016 pad 1.88: 1 0,0.127; 2 2.54,-0.127; 3 5.08,0.127
1X02_LOCK = drill 1.016 pad 1.88: 1 -0.178,0; 2 2.718,0
L5650M = smd 1.8 x 4: 1 -2.5,0; 2 2.5,0
CHIP-LED0805 = smd 1.2 x 1.2: A 0,-1.05; C 0,1.05
GM5WA94310A = smd 0.7 x 1.65: 1 -0.95,-1.675; 3 0.95,-1.675; 4 0.95,1.675; 6 -0.95,1.675 | smd 0.6 x 1.65: 2 0,-1.675; 5 0,1.675
EC11E1534408 = drill 1 pad 1.778 octagon: A -2.5,-7.5; B 2.5,-7.5; C 0,-7.5; D -2.5,7; E 2.5,7 | hole 3.2: -5.5,0; 5.5,0
TAC_SW_IP40 = drill 1.4 pad 2.54 octagon: 1 -6.35,3.81; 2 6.35,3.81; 3 -6.35,-3.81; 4 6.35,-3.81
SOT23 = smd 1 x 1.4: 1 -0.95,-1.1; 2 0.95,-1.1; 3 0,1.1
R0603 = smd 1 x 1.1: 1 -0.85,0; 2 0.85,0
DM3AT = smd 0.7 x 1.2: 1 3.2,0.6; 2 2.1,0.6; 3 1,0.6; 4 -0.1,0.6; 5 -1.2,0.6; 6 -2.3,0.6; 7 -3.4,0.6; 8 -4.5,0.6; B -5.6,0.6 | smd 1 x 0.8: A -6.05,-9.9 | smd 1 x 1.2: NC0 -6.05,-3.7; NC1 4.75,0.6 | smd 1 x 2.8: NC2 -6.05,-14.05 | smd 1 x 1.9: NC3 7.1,-14.5
F/EE17P = drill 1.194 pad 2.54 octagon: 1 -5.004,0; 2 5.004,0
SJ_2S-NOTRACE = smd 0.635 x 1.27: 1 -0.401,0; 2 0.413,0
HE14_H_2 = drill 1 pad 1.676 square: 1 -1.27,0 | drill 1 pad 1.676 octagon: 2 1.27,0
PAD.03X.05 = smd 1.27 x 1.27: P$1 0,0
TQFP_44 = smd 1.5 x 0.5: 1 -5.8,4; 2 -5.8,3.2; 3 -5.8,2.4; 4 -5.8,1.6; 5 -5.8,0.8; 6 -5.8,0; 7 -5.8,-0.8; 8 -5.8,-1.6; 9 -5.8,-2.4; 10 -5.8,-3.2; 11 -5.8,-4; 23 5.8,-4; 24 5.8,-3.2; 25 5.8,-2.4; 26 5.8,-1.6; 27 5.8,-0.8; 28 5.8,0; 29 5.8,0.8; 30 5.8,1.6; 31 5.8,2.4; 32 5.8,3.2; 33 5.8,4 | smd 0.5 x 1.5: 12 -4,-5.8; 13 -3.2,-5.8; 14 -2.4,-5.8; 15 -1.6,-5.8; 16 -0.8,-5.8; 17 0,-5.8; 18 0.8,-5.8; 19 1.6,-5.8; 20 2.4,-5.8; 21 3.2,-5.8; 22 4,-5.8; 34 4,5.8; 35 3.2,5.8; 36 2.4,5.8; 37 1.6,5.8; 38 0.8,5.8; 39 0,5.8; 40 -0.8,5.8; 41 -1.6,5.8; 42 -2.4,5.8; 43 -3.2,5.8; 44 -4,5.8
SO-08 = smd 0.6 x 2.2: 1 -1.905,-2.6; 2 -0.635,-2.6; 3 0.635,-2.6; 4 1.905,-2.6; 5 1.905,2.6; 6 0.635,2.6; 7 -0.635,2.6; 8 -1.905,2.6
DD-12864WE-4A = smd 0.4 x 2: 1 -10.15,-0.5; 2 -9.45,-0.5; 3 -8.75,-0.5; 4 -8.05,-0.5; 5 -7.35,-0.5; 6 -6.65,-0.5; 7 -5.95,-0.5; 8 -5.25,-0.5; 9 -4.55,-0.5; 10 -3.85,-0.5; 11 -3.15,-0.5; 12 -2.45,-0.5; 13 -1.75,-0.5; 14 -1.05,-0.5; 15 -0.35,-0.5; 16 0.35,-0.5; 17 1.05,-0.5; 18 1.75,-0.5; 19 2.45,-0.5; 20 3.15,-0.5; 21 3.85,-0.5; 22 4.55,-0.5; 23 5.25,-0.5; 24 5.95,-0.5; 25 6.65,-0.5; 26 7.35,-0.5; 27 8.05,-0.5; 28 8.75,-0.5; 29 9.45,-0.5; 30 10.15,-0.5
SOT-23 = smd 0.6 x 1.05: 1 -0.95,-1.35; 2 0,-1.35; 3 0.95,-1.35; 4 0.95,1.35; 5 -0.95,1.35
SOT_223 = smd 1.9 x 1.9: 1 -2.7,0; 3 2.7,0 | smd 1.1 x 1.9: 2 0,0 | smd 4.5 x 1.9: 4 0,6.2
CRYSTAL-OSC-SMD-5X3 = smd 1.9 x 1.1: 1 -1.85,-1.15; 2 1.85,-1.15; 3 1.85,1.15; 4 -1.85,1.15

### Placement (x,y rotation side)
C1  36.31,3.5 270 top
C2  37.08,19.43 90 bottom
C3  23.75,19.56 45 bottom
C4  22.35,5.08 315 bottom
C5  35.94,6.35 225 bottom
C6  22.41,4.94 270 top
C7  65.91,4.19 180 bottom
C8  62.48,22.48 90 bottom
C9  71.25,21.97 270 bottom
C10  38.1,4.19 270 top
C11  21.34,6.1 315 bottom
C12  17.65,10.03 135 bottom
C13  60.71,5.59 270 bottom
C14  64.77,8.38 0 bottom
C15  57.15,24.89 180 bottom
C16  47.37,28.19 0 bottom
C17  50.8,28.19 180 bottom
C18  48.9,34.42 180 bottom
C19  46.48,13.21 270 bottom
C20  72.26,38.1 0 bottom
C21  57.91,27.3 270 bottom
D1  70.48,28.83 0 bottom
D2  64.39,18.54 180 bottom
J1  79,20 270 bottom
J5  9.12,2 180 bottom
J6  60,37.21 270 bottom
J8  7.71,38 180 bottom
JP3  80.41,38 180 bottom
L1  64.77,13.34 270 bottom
LED1  16.5,18.5 0 top
LED2  43,6 180 top
LED3  47,6 180 top
LED4  51,6 180 top
LED5  55,6 180 top
LED6  39.5,18.5 0 top
LED7  65.22,14.97 90 top
NAV1  49,31 0 top
NAV2  49,15 0 top
Q1  51.24,17.41 90 bottom
Q2  53.15,14.93 90 bottom
Q3  51.24,12.45 90 bottom
Q4  65.53,28.83 90 bottom
R1  34.36,4.45 90 top
R2  46.48,26.04 270 bottom
R3  51.69,26.04 270 bottom
R4  48.77,36.07 180 bottom
R5  72.77,21.97 90 bottom
R6  72.77,18.67 90 bottom
R7  72.01,9.53 270 bottom
R8  45.59,10.92 180 bottom
R9  15.24,30.86 270 bottom
R10  15.24,24.51 270 bottom
R11  15.24,17.91 270 bottom
R12  15.11,11.56 270 bottom
R13  15.11,4.95 270 bottom
R14  57.15,23.5 0 bottom
R15  56.39,27.3 90 bottom
R16  6.86,2.92 90 bottom
R17  59.06,16.52 180 bottom
R18  46.5,35.26 270 bottom
R19  44.96,26.04 90 bottom
R20  53.09,26.04 270 bottom
R21  44.7,13.21 90 bottom
R22  74.04,31.24 180 bottom
R23  76.07,38.1 180 bottom
R24  16.66,18.67 90 bottom
R25  20.57,24.51 270 bottom
R26  39.72,18.54 90 bottom
R27  43,6 90 bottom
R28  47,6 90 bottom
R29  51,6 90 bottom
R30  62.61,27.05 90 bottom
R31  70.48,26.67 180 bottom
R32  55,6 90 bottom
R33  59.06,14.93 180 bottom
R34  59.06,13.47 180 bottom
SD_CARD  28,24 180 bottom
SG1  66,30 90 top
SJ1  57.91,21.84 270 bottom
SJ2  60.2,21.84 90 bottom
SW1  13.34,32 90 bottom
SW2  13.34,26 90 bottom
SW3  13.34,20 90 bottom
SW4  13.34,14 90 bottom
SW5  13.34,8 90 bottom
TP1  70.1,7.87 0 bottom
TP2  72.77,24.51 0 bottom
TP3  72.9,14.1 0 bottom
U1  29.21,12.95 315 bottom
U2  74.17,34.67 90 bottom
U3  28,8.5 0 top
U4  69.98,12.06 180 bottom
U5  77.98,5.21 270 bottom
X1  19.43,7.87 315 bottom

### Tracks (layer width: path | path; a pad name or v marks a point on that pad's centre or on a via)
!MCLR!
  Bottom 0.254: U1.18 32.75,8.28 33.53,7.49 33.53,7.24 32.51,6.22 32.51,1.14 32.26,0.89 20.57,0.89 20.19,0.51 9.27,0.51 9.14,0.64 9.14,1.85 J5.1 7.06,1.87 R16.1
+3V3L  (via drill 0.3 pad 0.61)
  Top 0.254: C6.1 22.41,6.15 22.48,6.22 | LED3.A LED4.A LED5.A | v58.67,6.73 57.02,6.73 56.64,7.11 55.06,7.11 | LED2.A 44,7.05 v44.07,6.86 | v45.85,6.86 46.81,6.86 LED3.A | v15.11,10.03 15.11,9.91 15.24,9.78 | v15.24,29.34 15.24,29.21 | LED3.A v47,10.91 v46.99,10.92 | v23.75,6.48
  Top 0.406: U3.9 23.45,6.52 | v23.75,18.41 26.16,18.41 | v27.81,22.73 27.81,19.81 26.42,18.41 26.16,18.41 | 26.16,18.41 21.35,13.6 21.35,11.18 | 21.35,11.18 U3.6 21.35,6.34 21.46,6.22 22.48,6.22 23.24,6.22 23.45,6.43 23.45,6.52 | 23.45,6.52 v23.75,6.48 23.75,5.21 24,4.95 32.26,4.95 | 32.26,4.95 v33.66,6.35 | 32.26,4.95 32.26,1.27 32.77,0.76 38.23,0.76 v39.12,1.65 | 55.06,7.11 LED5.A | 21.35,11.18 15.25,11.18 15.24,11.18 | 15.24,11.18 v15.24,16.38 v15.24,22.99 15.24,29.21 | 15.24,11.18 15.24,9.78 15.24,4.83 v14.48,4.06 12.7,4.06 11.66,3.03 J5.2 | v15.24,29.34 15.24,30.48 15.62,30.86 15.62,33.27 16,33.66 v21.21,33.66 33.66,33.66 34.8,32.51 v41.15,32.51
  Bottom 0.254: U1.28 24.98,8.85 24,7.87 24,6.73 v23.75,6.48 | v23.75,6.48 C4.1 | R16.2 11.34,3.77 11.68,3.43 11.68,2.15 J5.2 | U1.40 25.67,17.63 C3.1 | U1.17 33.44,8.85 C5.1 | v23.75,6.48 | 35.25,6.86 C5.1 | v33.66,6.35 34.74,6.35 C5.1 | v44.07,6.86 v45.85,6.86 | v14.48,4.06 15.07,4.06 R13.2 | R12.2 v15.11,10.03 | R11.2 v15.24,16.38 | R10.2 v15.24,22.99 | R9.2 v15.24,29.34 | v46.99,10.92 R8.2 | TP1.P$1 70.1,6.6 69.85,6.35
  Bottom 0.305: U2.3 73.03,35.31 73.28,35.56 73.28,37.93 C20.1 | R31.2 72.01,26.67 72.26,26.92 72.26,28.81 D1.C
  Bottom 0.406: R20.1 53.09,29.08 52.45,29.72 51.69,29.72 | 51.69,29.72 45.47,29.72 44.96,29.21 44.96,28.32 | 44.96,28.32 R19.2 | 51.69,29.72 51.69,34.67 | 51.69,34.67 51.69,35.81 51.44,36.07 R4.2 | 51.69,34.67 51.82,34.54 64.39,34.54 64.85,35 SG1.2 66.3,35.31 68.45,35.31 | U2.3 68.45,35.31 | 68.45,35.31 68.45,30.61 68.71,30.35 72.14,30.35 72.28,30.2 D1.C | C3.1 24.29,18.96 v23.75,18.41 | v27.81,22.73 27.81,23.31 SD_CARD.4 | v39.12,1.65 58.29,1.65 58.67,2.03 v58.67,6.73 58.93,6.99 C13.1 61.97,6.99 62.61,6.35 69.85,6.35 70.23,5.97 71.02,5.97 U5.4 | v21.21,33.66 21.7,33.66 SD_CARD.A | v41.15,32.51 41.15,28.45 41.4,28.19 44.83,28.19 44.96,28.32
  Bottom 0.61: R7.2 72.01,5.44 U5.4 U5.2
+5VL  (via drill 0.3 pad 0.61)
  Top 0.406: LED7.3 LED7.2 LED7.1 66.89,12.36 67.18,12.06 v69.34,12.06
  Bottom 0.61: 66.17,10.71 U4.5 69.03,11.75 v69.34,12.06 74.17,12.06 75.12,11.11 J1.1 76.45,9.78 76.71,9.53 80.52,9.53 81.03,9.02 81.03,2.92 80.61,2.51 U5.3 75.66,2.51 75.06,1.91 68.45,1.91 67.94,2.41 67.94,4.17 C7.+ | 66.17,10.71 64.89,10.71 L1.2 | C14.1 66.17,10.71
  pour Top (no thermals): 66.8,16.26 66.8,17.53 67.06,17.78 68.58,17.78 68.83,17.53 68.83,12.19 68.58,11.94 67.06,11.94 66.8,12.19 66.8,13.72 67.82,13.72 67.94,13.84 67.94,14.86 67.56,14.86 67.56,15.11 67.94,15.11 67.94,16.13 67.82,16.26
BUZZER_PWM
  Bottom 0.254: U1.5 32.75,17.63 35.18,20.07 35.18,21.46 35.94,22.23 41.78,22.23 42.93,21.08 52.32,21.08 53.47,22.23 54.86,22.23 55.75,21.34 57.82,21.34 SJ1.2 60.19,21.43 SJ2.1
CAN_RX  (via drill 0.3 pad 0.61)
  Top 0.254: v69.47,36.2 69.47,33.91 68.83,33.27 64.14,33.27 59.82,28.96 v35.69,28.96
  Bottom 0.254: v69.47,36.2 69.47,36.32 69.72,36.58 U2.4 | v35.69,28.96 35.18,28.96 34.29,28.07 34.29,22.61 31.05,19.36 U1.2
CAN_TX  (via drill 0.3 pad 0.61)
  Top 0.254: v69.72,32.77 64.39,32.77 60.07,28.45 36.32,28.45 v35.69,27.81
  Bottom 0.254: v69.72,32.77 U2.1 | v35.69,27.81 35.69,26.54 34.8,25.65 34.8,21.94 U1.3
CANH
  Bottom 0.305: J1.14 78.93,26.35 77.72,27.56 77.72,31.11 78.74,32.13 78.74,33.78 78.49,34.04 U2.7 75.31,34.04 75.06,34.29 75.06,37.93 R23.1
CANL
  Bottom 0.305: U2.6 79.25,35.31 | 79.25,35.31 79.25,36.45 79.38,36.58 82.82,36.58 83.12,36.88 JP3.2 | 79.25,35.31 79.25,29.14 J1.16
CTRL_!SS!  (via drill 0.3 pad 0.61)
  Top 0.254: J1.2 79,6.61 78.74,6.35 61.09,6.35 58.04,3.3 45.47,3.3 45.21,3.56 45.21,13.21 44.96,13.46 39.88,13.46 39.37,12.95 33.78,12.95 30.48,16.26 v30.48,17.14
  Bottom 0.254: v30.48,17.14 29.34,18.29 29.34,18.67 30.48,19.82 U1.1
CTRL_IRQ_IN  (via drill 0.3 pad 0.61)
  Top 0.254: J1.10 80.08,21.27 80.26,21.08 80.26,19.3 80.77,18.8 80.77,17.14 81.28,16.64 81.28,14.61 81.79,14.1 81.79,4.57 81.53,4.32 62.1,4.32 59.05,1.27 40.89,1.27 40.64,1.52 40.64,9.02 38.73,10.92 31.24,10.92 v28.07,13.97
  Bottom 0.254: 27.37,19.36 U1.43 28.19,18.5 28.19,17.53 28.7,17.02 28.7,15.62 28.07,14.99 v28.07,13.97
CTRL_IRQ_OUT  (via drill 0.3 pad 0.61)
  Top 0.254: J1.12 80.2,23.81 80.39,23.62 80.39,21.84 80.77,21.46 80.77,19.56 81.28,19.05 81.28,17.4 81.79,16.89 81.79,14.86 82.3,14.35 82.3,4.06 82.04,3.81 62.36,3.81 59.31,0.76 40.39,0.76 40.13,1.02 40.13,8.76 38.48,10.41 30.99,10.41 30.23,11.18 29.21,11.18 28.45,11.94 v28.45,12.45
  Bottom 0.254: U1.4 31.5,17.5 31.5,15.49 v28.45,12.45
CTRL_MISO  (via drill 0.3 pad 0.61)
  Top 0.254: J1.8 79.95,18.73 80.26,18.41 80.26,16.89 80.77,16.38 80.77,14.35 81.28,13.84 81.28,5.21 80.9,4.83 61.85,4.83 58.8,1.78 41.4,1.78 41.15,2.03 41.15,9.27 38.99,11.43 31.5,11.43 28.96,13.97 28.96,14.61 v27.56,16
  Bottom 0.254: 26.84,18.75 U1.42 27.56,18 v27.56,16
CTRL_MOSI  (via drill 0.3 pad 0.61)
  Top 0.254: J1.6 79.95,16.19 80.26,15.88 80.26,14.1 80.77,13.59 80.77,5.71 80.39,5.33 61.59,5.33 58.55,2.29 41.91,2.29 41.66,2.54 41.66,9.53 39.24,11.94 31.75,11.94 29.84,13.84 29.84,14.73 28.45,16.13 28.45,16.76 28.32,16.89 27.43,16.89 v25.78,15.24
  Bottom 0.254: v25.78,15.24 25.78,15.25 U1.38
CTRL_SCK  (via drill 0.3 pad 0.61)
  Top 0.254: J1.4 79.95,13.65 80.26,13.34 80.26,6.1 80.01,5.84 61.34,5.84 58.29,2.79 45.09,2.79 44.7,3.17 44.7,12.57 44.45,12.83 40.13,12.83 39.75,12.45 32.13,12.45 30.61,13.97 30.61,15.24 v29.59,16.26
  Bottom 0.254: 27.94,19.94 U1.44 28.83,18.99 28.83,17.91 29.59,17.14 v29.59,16.26
GND  (via drill 0.3 pad 0.61)
  other vias: 89,34 89,32 89,30 89,28 89,26 89,24 89,22 89,20 89,18 89,16 89,14 89,12 89,10 89,8 89,6 1,34 1,32 1,30 1,28 1,26 1,24 1,22 1,20 1,18 1,16 1,14 1,12 1,10 1,8 1,6 44,39 42,39 40,39 30,39 28,39 26,39 24,39 17,39 49,39 84,1 82,1 80,1 78,1 76,1 74,1 72,1 70,1 68,1 66,1 64,1 62,1 31,3 29,3 27,3 22.84,20.48 24.37,20.48 29.07,20.73 25.77,22.64 26.65,12.6 38.97,7.65 19.54,4.22 20.68,4.73 17,5.49 16.11,8.54 16.37,13.74 16.24,21.49 18.65,24.54 18.53,17.68 24.11,26.7 32.62,26.7 34.27,2.06 37.96,2.06 29.19,5.74 24.88,7.01 76.19,8.62 76.19,7.22 68.06,8.37 61.46,10.78 61.46,9 57.77,11.67 49.9,14.59 47.74,14.08 52.82,15.35 48.76,17.51 68.06,19.8 60.19,25.89 54.73,25.38 50.28,32.5 46.34,32.5 67.43,31.86 70.98,31.48 57.14,33.26 70.47,24.62 25.77,16.41 32.12,16.54 25.26,10.19 32.12,9.68
  pour Top (rank 6, no thermals): 0,40 90,40 90,0 0,0
  pour Bottom (rank 6, no thermals): 0,40 90,40 90,0 0,0
ICSP_PGEC
  Bottom 0.254: J5.5 23.79,1.87 U1.23
ICSP_PGED
  Bottom 0.254: U1.24 27.37,6.54 23.37,2.54 20.7,2.54 19.94,3.3 17.92,3.3 J5.4
LED1
  Bottom 0.254: U1.15 34.47,9.98 35.43,9.02 38.86,9.02 40.01,7.87 42.8,7.87 42.93,7.75 42.93,6.92 R27.2
LED2
  Bottom 0.254: U1.14 35.17,10.55 36.2,9.53 39.37,9.53 40.51,8.38 46.61,8.38 46.99,8 R28.2
LED3
  Bottom 0.254: U1.13 35.62,11.12 36.58,10.16 39.75,10.16 40.89,9.02 46.74,9.02 47.62,8.13 50.42,8.13 51.05,7.49 51.05,6.9 R29.2
LED4
  Bottom 0.254: U1.12 36.2,11.68 37.21,10.67 40.13,10.67 41.27,9.53 47.12,9.53 47.75,8.89 50.42,8.89 51.56,7.75 54.23,7.75 55,6.98 R32.2
N$1
  Top 0.254: U3.26 35.35,6.65 34.42,5.71 34.42,5.61 R1.2
N$2
  Top 0.254: U3.27 36.05,5.22 36.07,5.21 36.25,4.95 C1.1
N$3
  Bottom 0.61: U4.1 65.58,13.41 64.77,14.22 L1.1 64.81,15.88 66.17,15.88 66.19,15.9 D2.A
N$4  (via drill 0.3 pad 0.61)
  Top 0.406: LED7.5 61.48,14.97 v61.47,14.99
  Bottom 0.406: v61.47,14.99 60.22,14.99 R33.2
  pour Top (no thermals): 64.26,15.11 64.52,15.11 64.64,15.24 64.64,15.37 65.41,16.13 65.66,16.13 65.79,16.13 65.79,13.84 65.41,13.84 64.64,14.61 64.64,14.73 64.52,14.86 64.26,14.86
N$5
  Bottom 0.61: U4.3 70.93,18.98 71.5,19.56 | 71.5,19.56 71.37,19.56 71.25,19.68 C9.2 R5.1 | 71.5,19.56 72.73,19.56 R6.2
N$6  (via drill 0.3 pad 0.61)
  Top 0.406: LED7.4 62.06,15.92 v61.47,16.51
  Bottom 0.406: v61.47,16.51 R17.2
  pour Top (no thermals): 62.87,16.13 64.9,16.13 65.15,16.38 65.15,18.92 64.9,19.18 63.12,19.18 62.87,18.92
N$7  (via drill 0.3 pad 0.61)
  Top 0.406: LED7.6 62.03,14.02 v61.47,13.46
  Bottom 0.406: v61.47,13.46 60.66,13.46 R34.2
  pour Top (no thermals): 62.87,13.84 64.9,13.84 65.15,13.59 65.15,10.92 64.9,10.67 63.12,10.67 62.87,10.92
N$8  (via drill 0.3 pad 0.61)
  Top 0.254: LED6.C 39.51,19.8 v39.5,20.07
  Bottom 0.254: v39.5,20.07 39.77,19.43 R26.2
N$9
  Bottom 0.406: Q2.3 R33.1
N$10
  Bottom 0.406: R17.1 53.23,16.52 Q1.3
N$11
  Bottom 0.406: R34.1 53.36,13.47 Q3.3
N$12
  Bottom 0.305: J6.4 57.51,31.26 J6.1 57.91,30.86 C21.1 R15.2
N$13
  Bottom 0.305: SG1.1 66.04,25.04 66.04,27.05 66.63,27.64 Q4.3 D1.A 68.71,28.81 68.71,26.92 68.96,26.67 R31.1
N$14
  Bottom 0.305: R15.1 56.39,24.98 C15.1 R14.2
N$15
  Bottom 0.305: R23.2 80.13,38.1 JP3.1
N$16
  Bottom 0.254: SJ1.1 57.91,23.41 R14.1
N$17  (via drill 0.3 pad 0.61)
  Top 0.254: LED1.C 16.5,20.06 v16.51,20.07
  Bottom 0.254: v16.51,20.07 LED1.C R24.2
N$18
  Bottom 0.254: NAV1.A 46.5,25.17 R2.2 R19.1
N$19
  Bottom 0.254: NAV1.B 51.5,25 R3.2 R20.2
N$20
  Bottom 0.254: NAV1.D R18.1 47.88,36.11 R4.1
N$21
  Bottom 0.254: NAV2.3 44.48,11.19 R8.1 | R21.1 44.7,10.96 R8.1 | R8.1 44.74,10.25 44.96,10.03 54.19,10.03 NAV2.4
N$22
  Bottom 0.305: R22.2 74.89,32.6 75.06,32.77 U2.8
N$24
  Bottom 0.254: SJ2.2 60.2,24.64 61.47,25.91 61.47,27.56 61.72,27.81 62.52,27.81 R30.2 64.41,27.9 Q4.1
N$37  (via drill 0.3 pad 0.61)
  Top 0.254: LED2.C v43,4.3
  Bottom 0.254: v43,4.3 R27.1
N$39  (via drill 0.3 pad 0.61)
  Top 0.254: LED3.C v47,4.3
  Bottom 0.254: v47,4.3 R28.1
N$40  (via drill 0.3 pad 0.61)
  Top 0.254: LED4.C v51,4.3
  Bottom 0.254: v51,4.3 R29.1
N$41  (via drill 0.3 pad 0.61)
  Top 0.254: LED5.C v55,4.3
  Bottom 0.254: v55,4.3 R32.1
NAV_A  (via drill 0.3 pad 0.61)
  Top 0.254: v33.15,14.99 36.96,18.8 v36.96,24
  Bottom 0.254: C16.2 46.48,28.16 R2.1 47.41,26.89 47.75,26.54 47.75,22.35 47.5,22.1 45.47,22.1 43.56,24 v36.96,24 | U1.21 31,6.59 30.1,7.49 30.1,11.94 v33.15,14.99
NAV_B  (via drill 0.3 pad 0.61)
  Top 0.254: v33.78,14.35 38.35,18.92 v38.35,23.24
  Bottom 0.254: C17.2 51.69,28.16 R3.1 50.32,26.89 50.23,26.8 50.23,21.84 49.97,21.59 44.2,21.59 42.55,23.24 v38.35,23.24 | U1.20 31.58,7.16 30.73,8 30.73,11.3 v33.78,14.35
NAV_OK  (via drill 0.3 pad 0.61)
  Top 0.254: v32.51,15.62 35.81,18.92 v35.81,24.89
  Bottom 0.254: C18.1 46.51,34.42 R18.2 38.86,34.42 38.48,34.04 38.48,25.15 38.23,24.89 v35.81,24.89 | U1.22 30.48,6.09 29.34,7.24 29.34,12.45 v32.51,15.62
NAV_RET  (via drill 0.3 pad 0.61)
  Top 0.254: v34.54,13.59 35.43,14.48 42.42,14.48 v42.67,14.22
  Bottom 0.254: U1.19 32.16,7.72 31.5,8.38 31.5,10.67 v34.54,13.59 | v42.67,14.22 44.54,14.22 R21.2 C19.1
OLED_!CS!  (via drill 0.3 pad 0.61)
  Top 0.254: U3.13 26.25,6.69 v25.65,6.1
  Bottom 0.254: v25.65,6.1 25.75,6.1 U1.25
OLED_!D/C!  (via drill 0.3 pad 0.61)
  Top 0.254: U3.15 27.65,10.2 v27.56,10.29
  Bottom 0.254: v27.56,10.29 27.56,9.04 U1.26
OLED_!RES!  (via drill 0.3 pad 0.61)
  Top 0.254: v26.54,10.29 26.92,9.91 26.92,8.53 U3.14
  Bottom 0.254: U1.27 25.69,8.29 26.42,9.02 26.42,10.29 v26.54,10.29
OLED_PWR_EN  (via drill 0.3 pad 0.61)
  Top 0.254: v53.98,21.21 70.74,21.21 70.99,20.95 v70.99,9.91
  Bottom 0.254: U1.8 34.47,15.92 35.31,16.76 45.97,16.76 49.15,19.94 52.7,19.94 v53.98,21.21 | 70.99,10.41 70.99,10.65 U4.4 | v70.99,9.91 70.99,10.41 | 70.99,10.41 71.97,10.41 R7.1
OSC1
  Bottom 0.254: U1.30 23.95,9.98 23.11,9.14 22.33,9.14 X1.1 21.55,7.08 C11.1
OSC2
  Bottom 0.254: U1.31 23.38,10.55 22.73,9.91 21.34,9.91 19.81,8.38 18.31,8.38 X1.3 17.31,7.64 17.05,7.64 C12.1
RGB_B
  Bottom 0.254: U1.11 36.14,14.3 36.96,15.11 48.13,15.11 48.64,14.61 48.64,11.68 48.9,11.43 50.07,11.43 Q3.1
RGB_G
  Bottom 0.254: U1.10 35.62,14.79 36.45,15.62 50.41,15.62 Q2.1
RGB_R
  Bottom 0.254: U1.9 35.04,15.36 35.81,16.13 47.24,16.13 47.62,16.51 50.09,16.51 Q1.1
SD_!CS!
  Bottom 0.254: U1.37 23.95,15.92 21.08,18.8 21.08,21.08 21.34,21.34 26.8,21.34 27.56,22.1 29.72,22.1 30.1,22.48 SD_CARD.2
SD_DETECT  (via drill 0.3 pad 0.61)
  Top 0.254: v19.3,16.13 16.76,16.13 16.51,16.38 LED1.A
  Bottom 0.254: SD_CARD.B 20.84,23.4 R25.2 20.54,23.62 19.56,23.62 19.3,23.37 v19.3,16.13 19.3,15.75 22.28,12.77 U1.33
SPI1_MISO
  Bottom 0.254: SD_CARD.7 24.6,22.57 24.38,22.35 20.19,22.35 19.94,22.1 19.94,17.7 U1.35
SPI1_MOSI  (via drill 0.3 pad 0.61)
  Top 0.254: v20.45,15.75 20.45,16.51 21.84,17.91 v21.84,24.64 | v24.38,12.06 24.89,11.56 28.07,11.56 29.08,10.54 30.1,10.54 30.45,10.19 U3.19
  Bottom 0.254: SD_CARD.3 29,24.47 28.83,24.64 v21.84,24.64 | v20.45,15.75 20.76,15.75 U1.34 23.75,12.76 v24.38,12.06
SPI1_SCK  (via drill 0.3 pad 0.61)
  Top 0.254: U3.18 29.75,9.75 29.46,10.03 28.83,10.03 27.81,11.05 23.75,11.05 23.5,11.3 23.5,12.83 v24.64,13.97
  Bottom 0.254: SD_CARD.5 26.8,22.1 26.54,21.84 20.7,21.84 20.45,21.59 20.45,18.32 22.24,16.53 22.23,16.51 23.38,15.36 U1.36 24.64,14.13 v24.64,13.97
SW1
  Top 0.254: SW1.1 14.6,30.73 14.86,30.99 14.86,34.04 15.11,34.29 60.45,34.29 63.25,37.08 72.52,37.08 72.77,36.83 72.77,23.37 73.91,22.23 73.91,19.81 74.55,19.18 74.55,17.4 75.18,16.76 75.18,14.93 J1.3
  Bottom 0.254: R9.1 14.32,31.71 SW1.1
SW2
  Top 0.254: SW2.1 11.97,24.73 11.68,25.02 11.68,30.23 11.18,30.73 11.18,34.54 11.43,34.8 60.2,34.8 62.99,37.59 73.03,37.59 73.28,37.34 73.28,23.62 74.42,22.48 74.42,20.07 75.06,19.43 75.06,17.59 J1.5
  Bottom 0.254: SW2.1 13.68,24.73 14.35,25.4 15.2,25.4 R10.1
SW3
  Top 0.254: SW3.1 12,18.73 11.68,19.05 11.68,24.26 11.18,24.77 11.18,29.97 10.67,30.48 10.67,35.05 10.92,35.31 59.94,35.31 62.74,38.1 73.53,38.1 73.79,37.85 73.79,23.88 74.93,22.73 74.93,20.26 J1.7
  Bottom 0.254: SW3.1 15.21,18.73 R11.1
SW4
  Top 0.254: SW4.1 11.91,12.73 11.68,12.95 11.68,18.29 11.18,18.8 11.18,24 10.67,24.51 10.67,29.59 10.16,30.1 10.16,35.56 10.41,35.81 53.21,35.81 56.01,38.61 74.04,38.61 74.3,38.35 74.3,24.13 76.33,22.1 76.33,21.4 J1.9
  Bottom 0.254: SW4.1 14.79,12.73 R12.1
SW5
  Top 0.254: SW5.1 11.94,6.73 11.56,7.11 11.56,12.32 11.18,12.7 11.18,18.03 10.67,18.54 10.67,23.75 10.16,24.26 10.16,29.34 9.65,29.84 9.65,35.94 10.03,36.32 52.96,36.32 55.75,39.12 74.3,39.12 74.8,38.61 74.8,24.38 75.31,23.88 76.39,23.88 J1.11
  Bottom 0.254: SW5.1 14.19,6.73 R13.1
UART_RX
  Bottom 0.254: U1.32 22.27,10.54 21.59,10.54 17.78,14.35 17.78,35.43 17.4,35.81 13.08,35.81 12.76,36.13 12.76,37.85 J8.3
UART_TX  (via drill 0.3 pad 0.61)
  Top 0.254: v25.65,19.68 25.65,21.21 25.4,21.46 22.99,21.46 22.73,21.72 22.73,25.53 22.61,25.65 16.76,25.65 16.51,25.91 v16.51,32.13
  Bottom 0.254: U1.41 26.24,18.21 25.65,18.8 v25.65,19.68 | v16.51,32.13 16.51,34.8 16.13,35.18 8.13,35.18 7.75,35.56 7.75,37.81 J8.1
VCAP
  Bottom 0.254: U1.7 35.43,18.03 36.57,18.03 C2.1
VCC_OLED  (via drill 0.3 pad 0.61)
  Top 0.254: 60.71,18.41 60.71,20.32 60.45,20.57 54.36,20.57 53.85,20.07 47.37,20.07 44.2,16.89 40.89,16.89 40.34,17.45 LED6.A
  Top 0.406: v61.59,18.41 60.71,18.41 59.56,18.41 59.18,18.03 59.18,9.14 v57.66,7.62 | v39.12,2.79 39.12,6.22 38.86,6.48 38.1,6.48 | U3.28 36.75,6.68 36.96,6.48 38.1,6.48 | C10.1 38.1,6.48
  Bottom 0.254: TP2.P$1 R5.2
  Bottom 0.406: v61.59,18.41 62.46,18.41 D2.C | 62.4,20.99 C8.1 | R5.2 C9.1 71.21,22.86 69.09,22.86 67.2,20.97 62.59,20.97 | v57.66,7.62 57.66,3.3 57.15,2.79 v39.12,2.79
  Bottom 0.61: D2.C 62.59,20.97 C8.1

### Text on the board
tNames: 10/2014 | Paul M | IGreBot 2015 | microBoard - HMI v1 | SD | OLED
bNames: AUDIO | TX | UART | RX | CAN | +9V | RCA | BUZ | GND | +3V3 | ICSP